# EAGLE design moisture-meter (EAGLE 7.4.0)
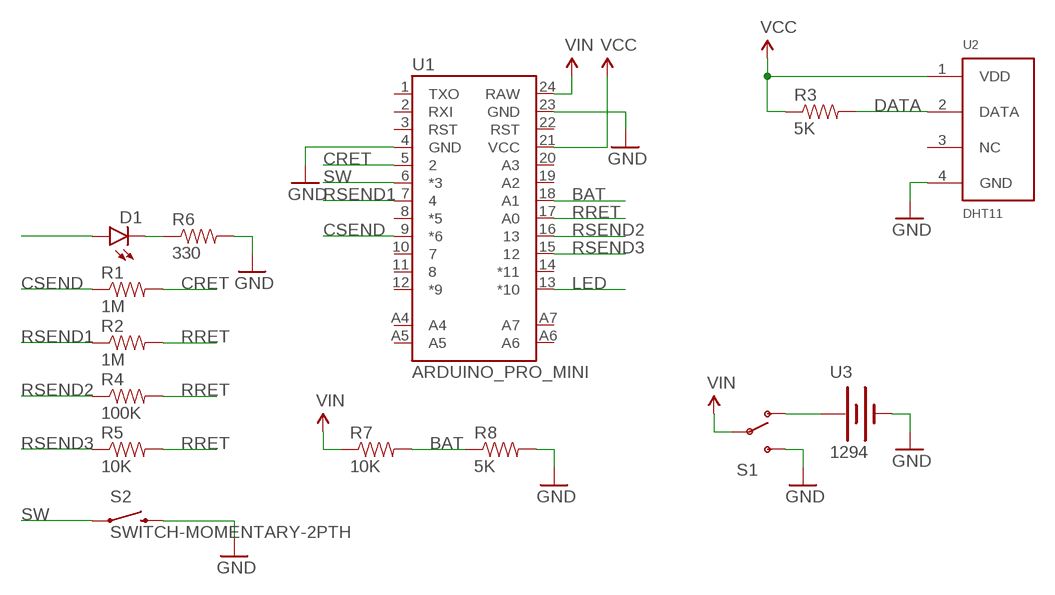
[diagram p0: schematic, sheet 1]

## Parts
D1  LED5MM  [LED5MM]
R1  1M  RESISTORPTH-1/4W  [AXIAL-0.4]
R2  1M  RESISTORPTH-1/4W  [AXIAL-0.4]
R3  5K  RESISTORPTH-1/4W  [AXIAL-0.4]
R4  100K  RESISTORPTH-1/4W  [AXIAL-0.4]
R5  10K  RESISTORPTH-1/4W  [AXIAL-0.4]
R6  330  RESISTORPTH-1/4W  [AXIAL-0.4]
R7  10K  RESISTORPTH-1/4W  [AXIAL-0.4]
R8  5K  RESISTORPTH-1/4W  [AXIAL-0.4]
S1  SWITCH-SPDTPTH  [SWITCH-SPDT]
S2  SWITCH-MOMENTARY-2PTH  [TACTILE-PTH]
U1  ARDUINO_PRO_MINI  [ARDUINO_PRO_MINI]
U2  DHT11  [DHT11]
U3  1294  [1294]

## Nets
BAT: R7.P$2 R8.P$1 U1.18(A1)
CRET: R1.P$2 U1.5
CSEND: R1.P$1 U1.9(*6)
DATA: R3.P$2 U2.2(DATA)
GND: R6.P$2 R8.P$2 S1.3(S) S2.3 U1.4(GND) U1.23(GND) U2.4(GND) U3.-
LED: D1.A U1.13(*10)
N$1: D1.K(C) R6.P$1
N$2: S1.1(O) U3.+
RRET: R2.P$2 R4.P$2 R5.P$2 U1.17(A0)
RSEND1: R2.P$1 U1.7
RSEND2: R4.P$1 U1.16
RSEND3: R5.P$1 U1.15
SW: S2.1 U1.6(*3)
VCC: R3.P$1 U1.21(VCC) U2.1(VDD)
VIN: R7.P$1 S1.2(P) U1.24(RAW)
Unconnected: U1.1(TXO) U1.2(RXI) U1.3(RST) U1.8(*5) U1.10 U1.11 U1.12(*9) U1.14(*11) U1.19(A2) U1.20(A3) U1.22(RST) U1.A4 U1.A5 U1.A6 U1.A7 U2.3(NC)

## Library data of the parts
D1 = SparkFun-LED:LED: LEDs Standard schematic elements and footprints for 5mm, 3mm, 1206, and 0603 sized LEDs. 5mm - Spark Fun Electronics SKU : COM-00529 (and others)
R1-R8 = SparkFun-Resistors:RESISTOR: Resistor Basic schematic elements and footprints for 0603, 1206, and PTH resistors.
S1 = SparkFun-Electromechanical:SWITCH-SPDT: SPDT Switch Simple slide switch, Spark Fun Electronics SKU : COM-00102 DPDT SMT slide switch, AYZ0202, SWCH-08179; PROD_ID: SWCH-08261
S2 = SparkFun-Electromechanical:SWITCH-MOMENTARY-2: Various NO switches- pushbuttons, reed, etc; PROD_ID: SWCH-08441
U1 = SparkFun-Boards:ARDUINO_PRO_MINI
U2 = dht:DHT11
U3 = keystone:1294

## Board
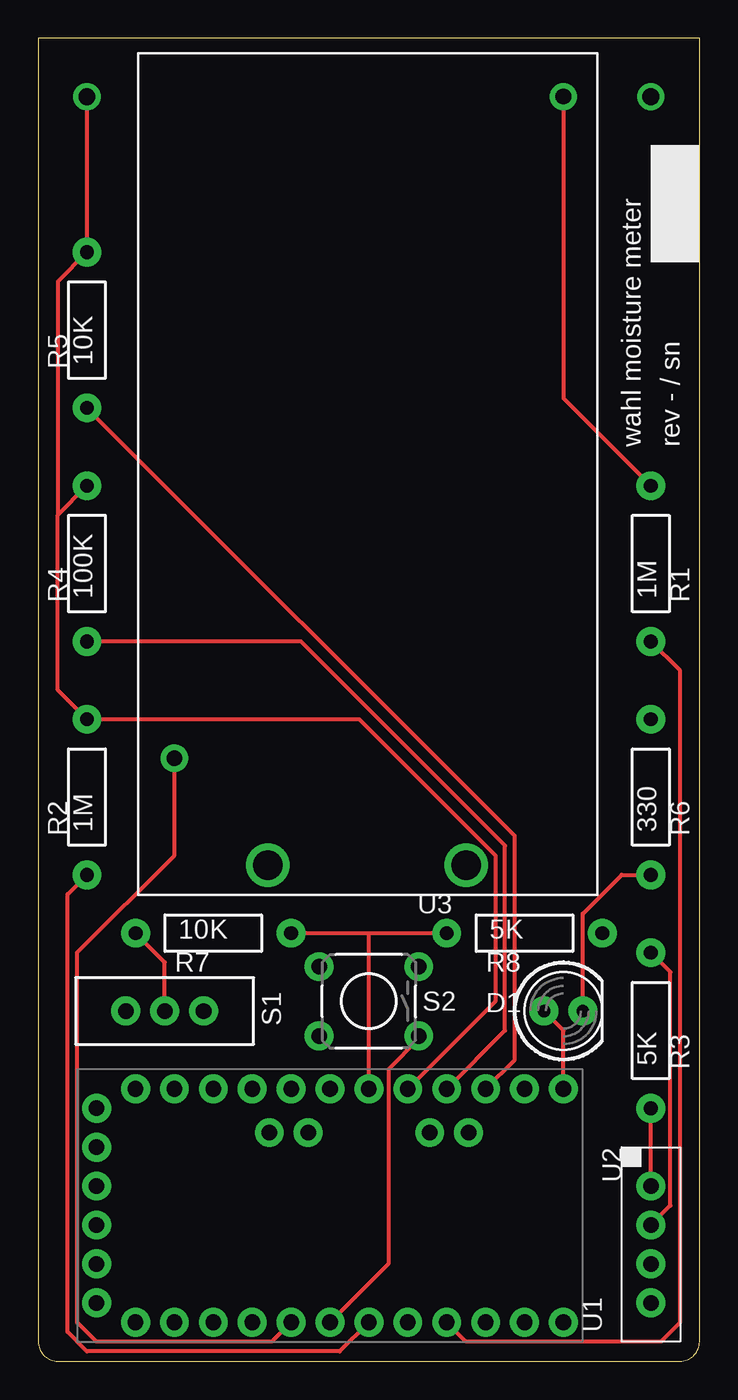
[diagram p1: board, top side]
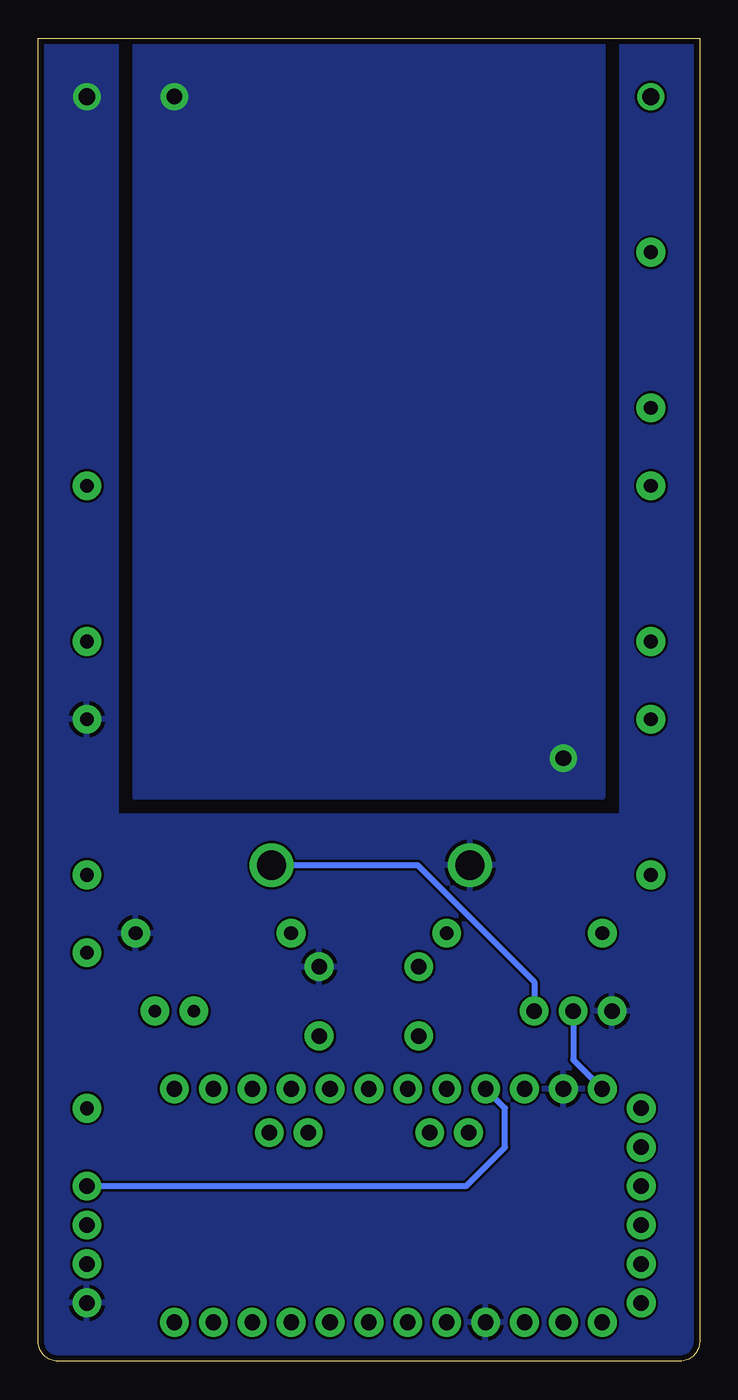
[diagram p2: board, bottom side, seen from below]

Size 43.18 x 86.36 mm. Coordinates in mm from the lower left corner, seen from the top.
Outline: 43.18,86.36 0,86.36 0,1.27 arc90 1.27,0 41.91,0 arc90 43.18,1.27 43.18,86.36
Copper layers (1*16): Top 0.0356mm / dielectric 1.5011mm / Bottom 0.0356mm
Design rules "LaenPCBOrder": minimum track width 6mil, minimum drill 13mil, track to track 6mil, track to pad 6mil, pad to pad 6mil, via to via 6mil, smd to smd 6mil, copper to edge 15mil, drill to drill 6mil, minimum pad ring 7mil, minimum via ring 7mil, stop-mask expansion 3mil, vias tented up to drill 0mil, thermal gap 10mil

### Footprints (pad centres in the part's own frame; a part is rotated, then mirrored left to right if it is on the bottom)
LED5MM = drill 0.813 pad 1.88: A -1.27,0; K 1.27,0
AXIAL-0.4 = drill 0.9 pad 1.88: P$1 -5.08,0; P$2 5.08,0
SWITCH-SPDT = drill 1.016 pad 1.88: 1 0,2.54; 2 0,0; 3 0,-2.54
TACTILE-PTH = drill 1.016 pad 1.88: 1 -3.251,2.261; 2 3.251,2.261; 3 -3.251,-2.261; 4 3.251,-2.261
ARDUINO_PRO_MINI = drill 1.016 pad 1.88: 1 -7.62,12.7; 2 -7.62,10.16; 3 -7.62,7.62; 4 -7.62,5.08; 5 -7.62,2.54; 6 -7.62,0; 7 -7.62,-2.54; 8 -7.62,-5.08; 9 -7.62,-7.62; 10 -7.62,-10.16; 11 -7.62,-12.7; 12 -7.62,-15.24; 13 7.62,-15.24; 14 7.62,-12.7; 15 7.62,-10.16; 16 7.62,-7.62; 17 7.62,-5.08; 18 7.62,-2.54; 19 7.62,0; 20 7.62,2.54; 21 7.62,5.08; 22 7.62,7.62; 23 7.62,10.16; 24 7.62,12.7; A4 4.763,1.429; A5 4.763,3.969; A6 4.763,-9.049; A7 4.763,-6.509; BLK -6.35,15.24; GND -3.81,15.24; GRN 6.35,15.24; RXI 1.27,15.24; TXO 3.81,15.24; VCC -1.27,15.24
DHT11 = drill 1.016 pad 1.88: 1 -3.81,0; 2 -1.27,0; 3 1.27,0; 4 3.81,0
1294 = drill 1.905: + 0,0; - 0,-12.954

### Placement (x,y rotation side)
D1  34.29,22.86 0 top
R1  40.01,52.07 90 top
R2  3.17,36.83 90 top
R3  40.01,21.59 90 top
R4  3.17,52.07 90 top
R5  3.17,67.31 90 top
R6  40.01,36.83 90 top
R7  11.43,27.94 0 top
R8  31.75,27.94 0 top
S1  8.26,22.86 270 top
S2  21.59,23.5 180 top
U1  19.05,10.16 90 top
U2  40.01,7.62 270 top
U3  27.94,32.38 270 top

### Tracks (layer width: path | path; a pad name or v marks a point on that pad's centre or on a via)
BAT
  Top 0.254: R8.P$1 21.59,27.94 | 21.59,27.94 R7.P$2 | U1.18 21.59,27.94
CRET  (via drill 1.02 pad 1.78)
  Top 0.254: U1.5 15.24,1.27 3.81,1.27 2.54,2.54 2.54,26.67 8.89,33.02 v8.89,39.37 | v34.29,82.55 34.29,62.87 R1.P$2
  pour Bottom: 6.35,87.63 6.35,36.83 36.83,36.83 36.83,87.63
CSEND
  Top 0.254: R1.P$1 41.91,45.09 41.91,2.54 40.64,1.27 27.94,1.27 U1.9
DATA
  Top 0.254: U2.2 41.27,10.16 41.27,25.4 R3.P$2
GND  (via drill 1.09 pad 1.78)
  other vias: 40.01,82.55
  pour Bottom: -1.27,87.63 5.08,87.63 5.08,35.56 38.1,35.56 38.1,87.63 44.45,87.63 44.45,-1.27 -1.27,-1.27
LED
  Top 0.254: U1.13 34.29,21.59 D1.A
N$1
  Top 0.254: D1.K 35.56,29.21 38.1,31.75 R6.P$1
N$2
  Bottom 0.406: U3.+ 18.41,32.38 10.79,24.77 S1.1
RRET  (via drill 1.09 pad 1.78)
  Top 0.254: U1.17 29.84,23.5 29.84,33.02 20.95,41.91 R2.P$2 1.27,43.81 1.27,55.24 | 1.27,55.24 R4.P$2 | 1.27,55.24 1.27,70.48 R5.P$2 v3.17,82.55
RSEND1
  Top 0.254: R2.P$1 1.91,30.48 1.91,1.91 3.17,0.64 19.68,0.64 U1.7
RSEND2
  Top 0.254: U1.16 30.48,21.59 30.48,33.66 17.14,46.99 R4.P$1
RSEND3
  Top 0.254: U1.15 31.11,19.68 31.11,34.29 R5.P$1
SW
  Top 0.254: S2.1 24.84,21.03 22.86,19.05 22.86,6.35 U1.6
VCC
  Top 0.254: U2.1 R3.P$1
  Bottom 0.406: U1.21 12.7,16.51 12.7,13.97 15.24,11.43 U2.1
VIN
  Top 0.254: S1.2 8.26,26.04 R7.P$1
  Bottom 0.406: S1.2 8.26,19.68 U1.24

### Text on the board
tPlace: wahl moisture meter | rev - / sn